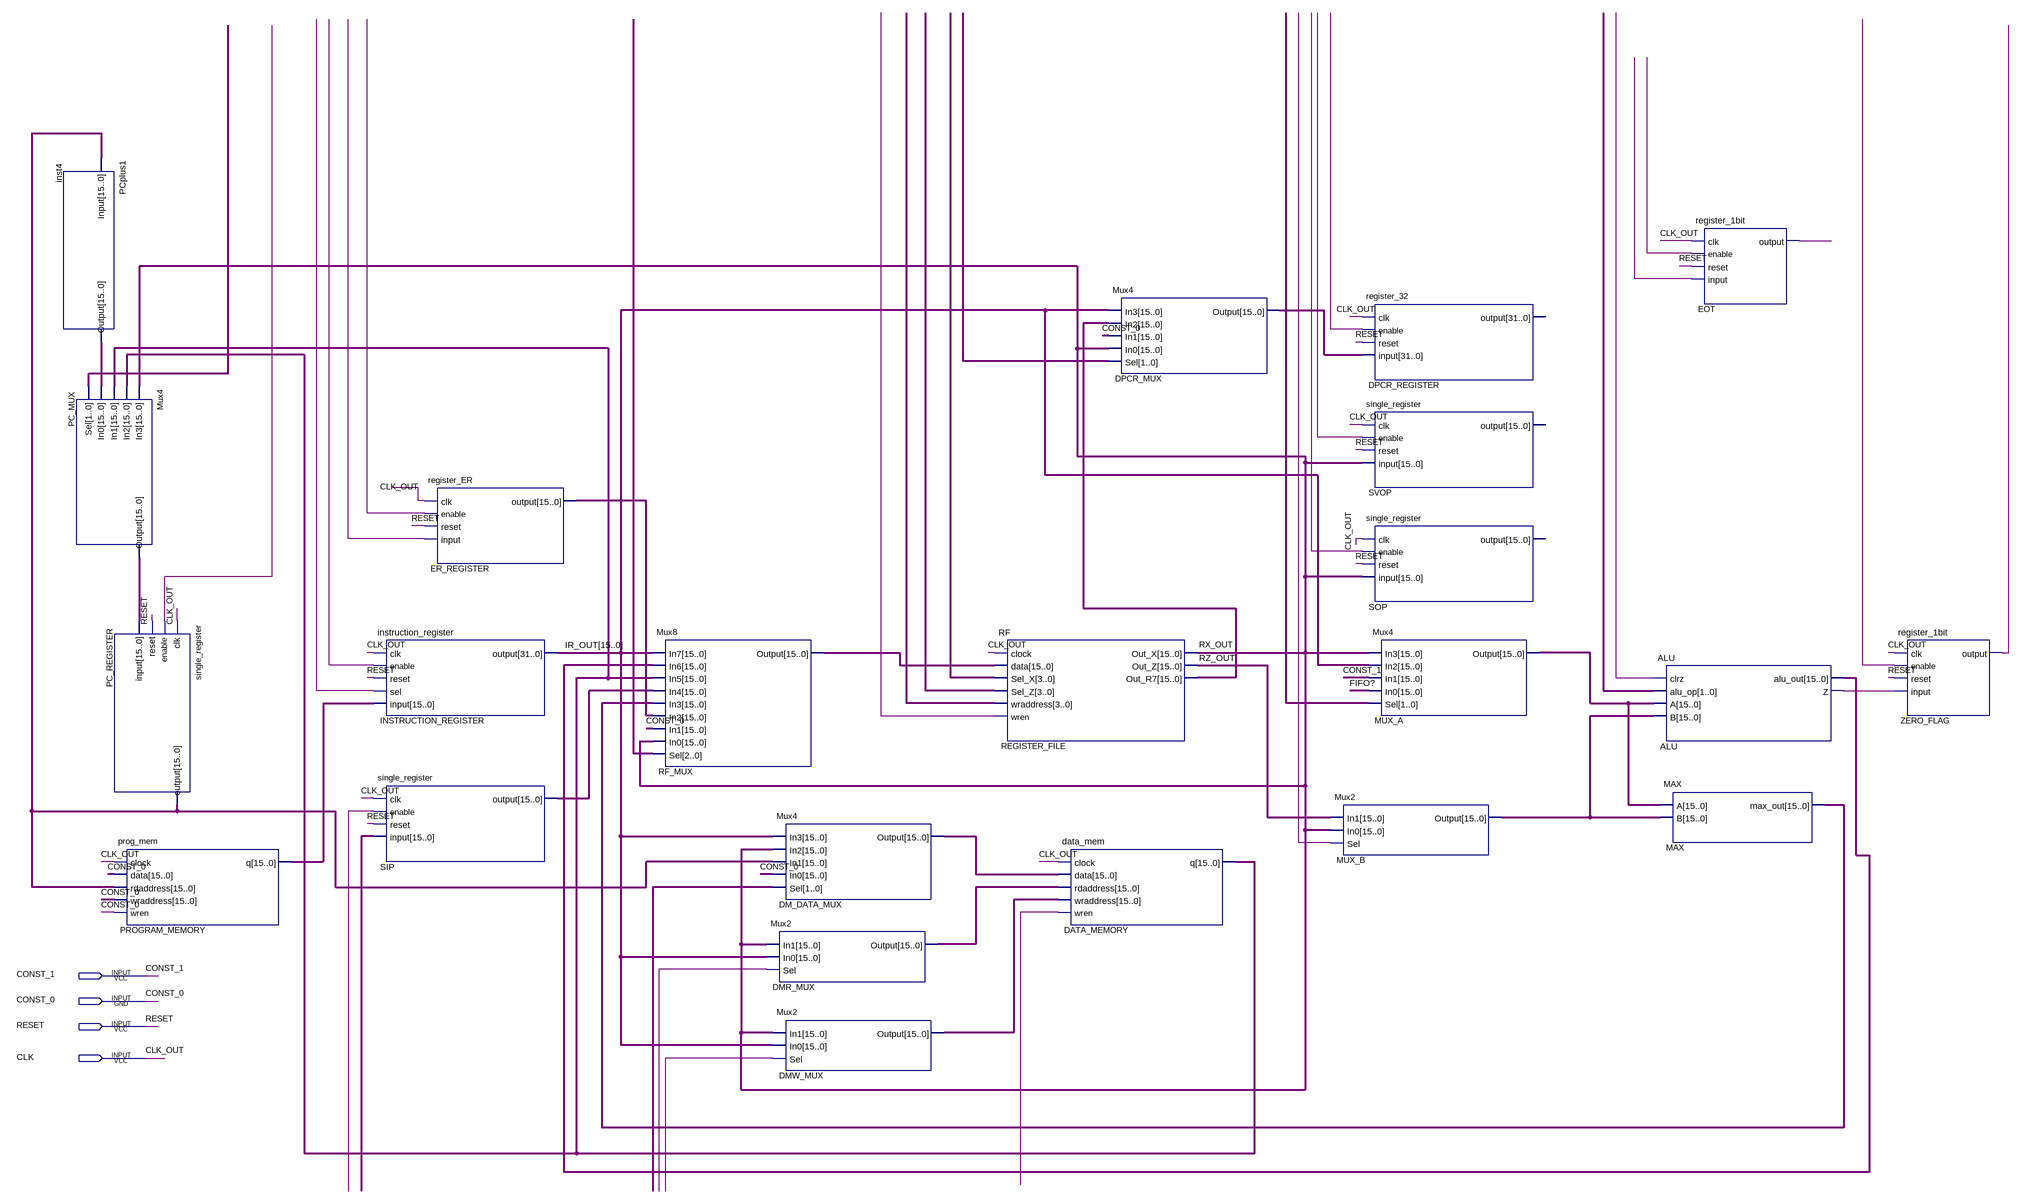
[diagram p0: schematic sheet]
// Quartus schematic Datapath.bdf as structural Verilog: 23 symbols, 4 pins
module Datapath (
  input  CONST_1,
  input  CONST_0,
  input  RESET,
  input  CLK
);

  wire ALU_z, EOT_output, \FIFO? , RX_OUT, RZ_OUT, undriven_4, undriven_7, undriven_8, undriven_9,
       undriven_10, undriven_11, undriven_13, undriven_16, undriven_17, undriven_18, undriven_20,
       undriven_21, undriven_22, undriven_23, undriven_25, undriven_26, undriven_27, undriven_28,
       ZERO_FLAG_output;
  wire [1:0] undriven_5, undriven_6, undriven_15, undriven_19, undriven_24;
  wire [2:0] undriven_14;
  wire [3:0] undriven, undriven_2, undriven_3;
  wire [15:0] ALU_alu_out, DATA_MEMORY_q, DM_DATA_MUX_output, DMR_MUX_output, DMW_MUX_output,
       ER_REGISTER_output, inst4_output, IR_OUT, MAX_max_out, MUX_A_output, MUX_B_output, PC_MUX_output,
       PC_REGISTER_output, PROGRAM_MEMORY_q, REGISTER_FILE_out_r7, RF_MUX_output, SIP_output, undriven_12;
  wire [31:0] DPCR_MUX_output;

  PCplus1 inst4 (.Input(PC_REGISTER_output), .Output(inst4_output));
  Mux4 PC_MUX (
    .In3({16{RX_OUT}}), .In2(DATA_MEMORY_q), .In1(DATA_MEMORY_q), .In0(inst4_output), .Sel(undriven_5),
    .Output(PC_MUX_output));
  single_register PC_REGISTER (
    .clk(CLK), .enable(undriven_13), .reset(RESET), .\input (PC_MUX_output), .\output (PC_REGISTER_output));
  prog_mem PROGRAM_MEMORY (
    .clock(CLK), .data({16{CONST_0}}), .rdaddress(PC_REGISTER_output), .wraddress({16{CONST_0}}),
    .wren(CONST_0), .q(PROGRAM_MEMORY_q));
  instruction_register INSTRUCTION_REGISTER (
    .clk(CLK), .enable(undriven_8), .reset(RESET), .sel(undriven_7), .\input (PROGRAM_MEMORY_q),
    .\output (IR_OUT));
  single_register SIP (.clk(CLK), .enable(undriven_11), .reset(RESET), .\input (undriven_12), .\output (SIP_output));
  register_ER ER_REGISTER (
    .clk(CLK), .enable(undriven_9), .reset(RESET), .\input (undriven_10), .\output (ER_REGISTER_output));
  Mux8 RF_MUX (
    .In7(IR_OUT), .In6(ALU_alu_out), .In5(DATA_MEMORY_q), .In4(SIP_output), .In3(MAX_max_out),
    .In2(ER_REGISTER_output), .In1({16{CONST_0}}), .In0({16{RX_OUT}}), .Sel(undriven_14),
    .Output(RF_MUX_output));
  Mux4 DM_DATA_MUX (
    .In3(IR_OUT), .In2({16{RX_OUT}}), .In1(PC_REGISTER_output), .In0({16{CONST_0}}), .Sel(undriven_15),
    .Output(DM_DATA_MUX_output));
  Mux2 DMR_MUX (.In1({16{RX_OUT}}), .In0(IR_OUT), .Sel(undriven_16), .Output(DMR_MUX_output));
  Mux2 DMW_MUX (.In1({16{RX_OUT}}), .In0(IR_OUT), .Sel(undriven_17), .Output(DMW_MUX_output));
  RF REGISTER_FILE (
    .clock(CLK), .data(RF_MUX_output), .Sel_X(undriven), .Sel_Z(undriven_2), .wraddress(undriven_3),
    .wren(undriven_4), .Out_X(RX_OUT), .Out_Z(RZ_OUT), .Out_R7(REGISTER_FILE_out_r7));
  data_mem DATA_MEMORY (
    .clock(CLK), .data(DM_DATA_MUX_output), .rdaddress(DMR_MUX_output), .wraddress(DMW_MUX_output),
    .wren(undriven_18), .q(DATA_MEMORY_q));
  Mux4 DPCR_MUX (
    .In3(IR_OUT), .In2(REGISTER_FILE_out_r7), .In1({16{CONST_0}}), .In0({16{RX_OUT}}), .Sel(undriven_6),
    .Output(DPCR_MUX_output));
  Mux2 MUX_B (.In1({16{RZ_OUT}}), .In0({16{RX_OUT}}), .Sel(undriven_20), .Output(MUX_B_output));
  register_32 DPCR_REGISTER (
    .clk(CLK), .enable(undriven_23), .reset(RESET), .\input (DPCR_MUX_output));  // open: output
  single_register SVOP (.clk(CLK), .enable(undriven_22), .reset(RESET), .\input ({16{RX_OUT}}));  // open: output
  single_register SOP (.clk(CLK), .enable(undriven_21), .reset(RESET), .\input ({16{RX_OUT}}));  // open: output
  Mux4 MUX_A (
    .In3({16{RX_OUT}}), .In2(IR_OUT), .In1({16{CONST_1}}), .In0({16{\FIFO? }}), .Sel(undriven_19),
    .Output(MUX_A_output));
  ALU ALU (
    .clrz(undriven_25), .alu_op(undriven_24), .A(MUX_A_output), .B(MUX_B_output), .alu_out(ALU_alu_out),
    .Z(ALU_z));
  MAX MAX (.A(MUX_A_output), .B(MUX_B_output), .max_out(MAX_max_out));
  register_1bit EOT (.clk(CLK), .enable(undriven_27), .reset(RESET), .\input (undriven_28), .\output (EOT_output));
  register_1bit ZERO_FLAG (
    .clk(CLK), .enable(undriven_26), .reset(RESET), .\input (ALU_z), .\output (ZERO_FLAG_output));

  // Other names for the same wires on the sheet: CLK_OUT = CLK
endmodule
